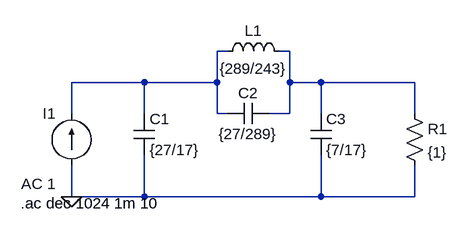
[diagram p0: schematic Draft2.asc]
Draft2.asc, the LTspice schematic file:
Version 4
SHEET 1 880 680
WIRE 176 32 160 32
WIRE 272 32 256 32
WIRE 48 80 -64 80
WIRE 160 80 160 32
WIRE 160 80 48 80
WIRE 272 80 272 32
WIRE 320 80 272 80
WIRE 464 80 320 80
WIRE -64 128 -64 80
WIRE 48 128 48 80
WIRE 160 128 160 80
WIRE 176 128 160 128
WIRE 272 128 272 80
WIRE 272 128 240 128
WIRE 320 128 320 80
WIRE 464 128 464 80
WIRE -64 256 -64 208
WIRE 48 256 48 192
WIRE 48 256 -64 256
WIRE 320 256 320 192
WIRE 320 256 48 256
WIRE 464 256 464 208
WIRE 464 256 320 256
FLAG -64 256 0
SYMBOL current -64 208 R180
WINDOW 0 24 80 Left 2
WINDOW 3 24 0 Left 2
WINDOW 123 24 -28 Left 2
WINDOW 39 0 0 Left 0
SYMATTR InstName I1
SYMATTR Value ""
SYMATTR Value2 AC 1
SYMBOL cap 32 128 R0
SYMATTR InstName C1
SYMATTR Value {27/17}
SYMBOL ind 160 48 R270
WINDOW 0 32 56 VTop 2
WINDOW 3 5 56 VBottom 2
SYMATTR InstName L1
SYMATTR Value {289/243}
SYMBOL cap 240 112 R90
WINDOW 0 0 32 VBottom 2
WINDOW 3 32 32 VTop 2
SYMATTR InstName C2
SYMATTR Value {27/289}
SYMBOL cap 304 128 R0
SYMATTR InstName C3
SYMATTR Value {7/17}
SYMBOL res 448 112 R0
SYMATTR InstName R1
SYMATTR Value {1}
TEXT -142 266 Left 2 !.ac dec 1024 1m 10

The netlist it stands for:
* Draft2.asc
I1 0 N001 AC 1
C1 N001 0 {27/17}
L1 N001 N002 {289/243}
C2 N002 N001 {27/289}
C3 N002 0 {7/17}
R1 N002 0 {1}
.ac dec 1024 1m 10
.backanno
.end